# Altium project T1_Card.PrjPcb (part 4 of 6)

## Sheet LM74700.SchDoc
size 431 x 279 mm; Date: Not shown in title block; ApprovedBy: Not shown in title block; CheckedBy: Not shown in title block; Author: Not shown in title block; CompanyName: Not shown in title block; DrawnBy: Andy Lin (TI); Engineer: Not shown in title block; Organization: Not shown in title block; Address1: Not shown in title block; Address2: Not shown in title block; Address3: Not shown in title block; Address4: Not shown in title block; DocumentNumber: 4; Revision: Use project parameter SCH_Rev; SheetNumber: 4; SheetTotal: 14; PageSetup: Record=PageOptions|CenterHorizontal=True|CenterVertical=True|PrintScale=1.00|XCorrection=1.00|YCorrection=1.00|PrintKind=0|BorderSize=5000000|LeftOffset=0|BottomOffset=0|Orientation=2|PaperLength=1000|PaperWidth=1000|Scale=100|PaperSource=15|PrintQuality=600|MediaType=1|DitherType=10|PaperKind=Letter|PrintScaleMode=1; CurrentTime: Not shown in title block; CurrentDate: Not shown in title block; Time: Not shown in title block; DocumentFullPathAndName: Not shown in title block; DocumentName: Not shown in title block; ModifiedDate: Not shown in title block; ImagePath: Not shown in title block
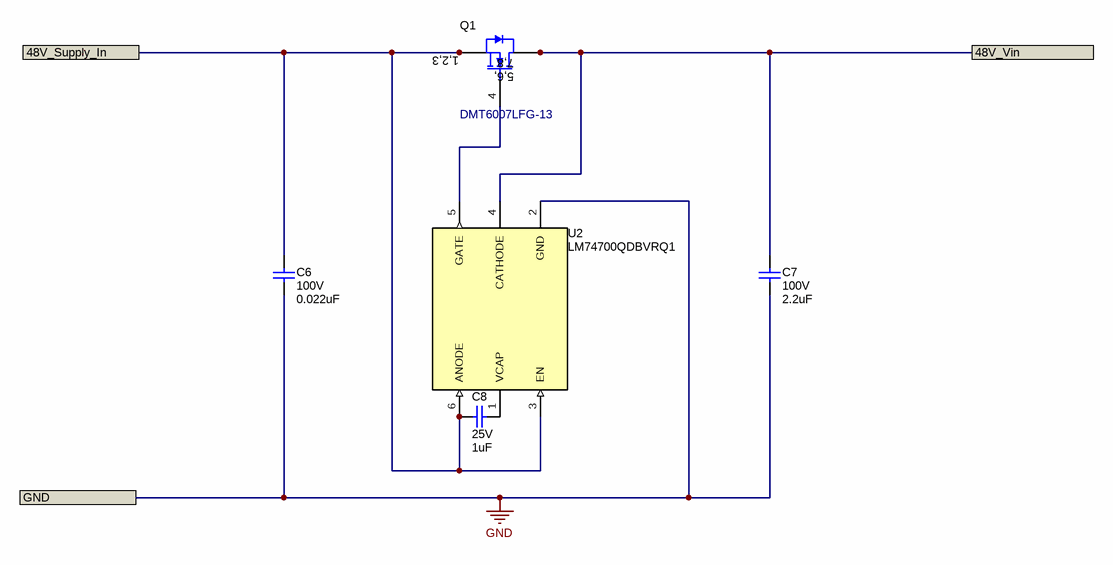
[diagram p7: LM74700.SchDoc]

### Parts
C6  VDC_V: 100V  ValueDisplayed: 0.022uF  [0805_HV]  (hidden comment: GRM21BR72A223KA01L)
C7  VDC_V: 100V  ValueDisplayed: 2.2uF  [1206_190]  (hidden comment: GRM31CR72A225KA73L)
C8  VDC_V: 25V  ValueDisplayed: 1uF  [0603]  (hidden comment: GCM188R71E105KA64D)
Q1  DMT6007LFG-13  [PowerDI3333-8]
U2  LM74700QDBVRQ1  [DBV0006A_N]

### Ports
48V_Supply_In, 48V_Vin, GND

### Nets
GND: C6.2 C7.2 U2.2(GND) ; port GND  [project net ILIM_GND]
48V_Supply_In: C6.1 C8.2 Q1.1(S) Q1.2(S) Q1.3(S) U2.3(EN) U2.6(ANODE) ; port 48V_Supply_In
48V_Vin: C7.1 Q1.5(D) Q1.6(D) Q1.7(D) Q1.8(D) Q1.9(D) U2.4(CATHODE) ; port 48V_Vin
NetC8_1: C8.1 U2.1(VCAP)
NetQ1_4: Q1.4(G) U2.5(GATE)

### Notes on the sheet
- Drawn By:
- SVN Rev:
- Number:
- TID #:
- Orderable:
- Rev:
- Sheet Title:
- File:
- Project Title:
- Designed for:
- Assembly Variant:
- Mod. Date:
- Sheet:
- Size:
- of
- B
- http://www.ti.com
- Texas Instruments and/or its licensors do not warrant the accuracy or completeness of this specification or any information contained therein. Texas Instruments and/or its licensors do not warrant that this design will meet the specifications, will be suitable for your application or fit for any particular purpose, or will operate in an implementation. Texas Instruments and/or its licensors do not warrant that the design is production worthy. You should completely validate and test your design implementation to confirm the system functionality for your application.
- Engineer:
- Contact:
- © Texas Instruments
- (in symbol CMP-0067553-1) 1,2,3; 7,8; 5,6,

### Library data of the parts
C6 = CMP-0008368-1: CAP, CERM, 0.022 uF, 100 V, +/- 10%, X7R, 0805; Manufacturer: MuRata; TaMin_C: -55°C; Polarized: N; SizeAreaWB_mm2: 6.75; Value1: Unknown; U/M: EA; TaMax_C: 125°C; SizeZ_mm: 1.45; SizeX_mm: 2; SizeY_mm: 1.25; Cap_Case: 0805; SizeArea_mm2: 2.5; Cap_F: 22nF; AEC Category: Q200; ComponentLink1URL: http://search.murata.co.jp/Ceramy/PnsearchViewAction.do?HnOFG=ON&HnNFG=ON&SEL_CNT=50&sLang=en&sKey=GRM21BR72A223KA01L&x=9&y=9&search=startwith; Supplier Part Number 2: 81-GRM21R72A223KA01L; Publisher: Texas Instruments; Supplier 2: Mouser; Supplier Part Number 3: 1403970; TempCo: X7R; Supplier 3: Farnell; Published: 2008-06-19; RoHS: Y; MountType: SMT; Value: 0.022uF; Supplier 1: Digi-Key; PackageReference: 0805; Tolerance_%: 10%; Value2: 100V; CompType: Capacitor; LatestRevisionDate: 2017-03-09; PartNumber: GRM21BR72A223KA01L; AEC Qualified: ?; ComponentLink1Description: Datasheet link; Supplier Part Number 1: 490-1658-1-ND; Technology: Ceramic
C7 = CMP-0008971-1: CAP, CERM, 2.2 uF, 100 V, +/- 10%, X7R, 1206_190; Manufacturer: MuRata; TaMin_C: -55°C; Polarized: N; SizeAreaWB_mm2: 10.92; Value1: Unknown; U/M: EA; Value: 2.2uF; TaMax_C: 125°C; SizeZ_mm: 1.9; SizeX_mm: 3.2; SizeY_mm: 1.6; Cap_Case: 1206; SizeArea_mm2: 5.12; Cap_F: 2.2µF; AEC Category: Q200; ComponentLink1URL: http://search.murata.co.jp/Ceramy/image/img/w_hinm/L0005E.pdf; Publisher: Texas Instruments; TempCo: X7R; Published: 2008-06-19; RoHS: Y; MountType: SMT; Supplier 1: Digi-Key; PackageReference: 1206_190; Tolerance_%: 10%; Value2: 100V; CompType: Capacitor; LatestRevisionDate: 2017-03-09; PartNumber: GRM31CR72A225KA73L; AEC Qualified: ?; ComponentLink1Description: Datasheet link; Supplier Part Number 1: 490-7209-1-ND; Technology: Ceramic
C8 = CMP-0007139-4: CAP, CERM, 1 uF, 25 V, +/- 10%, X7R, AEC-Q200 Grade 1, 0603; Manufacturer: MuRata; TaMin_C: -55°C; Polarized: N; SizeAreaWB_mm2: 4.68; Value1: Unknown; U/M: EA; Value: 1uF; TaMax_C: 125°C; SizeZ_mm: 1; SizeX_mm: 1.6; SizeY_mm: 0.8; SizeArea_mm2: 1.28; AEC Qualified: Y; Cap_F: 1µF; AEC Category: Q200; Supplier Part Number 2: 45Y5164; Publisher: Texas Instruments; Supplier 2: Newark; Supplier Part Number 3: 81-GCM188R71E105KA4D; TempCo: X7R; Supplier 3: Mouser; Published: 2008-06-19; RoHS: Y; MountType: SMT; Supplier 1: Digi-Key; PackageReference: 0603; Tolerance_%: 10%; Cap_Case: 0603; Value2: 25V; CompType: Capacitor; LatestRevisionDate: 2017-03-09; PartNumber: GCM188R71E105KA64D; ComponentLink1Description: Datasheet link; AEC Grade: 1; Supplier Part Number 1: 490-10673-1-ND; Technology: Ceramic; ComponentLink1URL: http://psearch.en.murata.com/capacitor/product/GCM188R71E105KA64%23.pdf
Q1 = CMP-0067553-1: MOSFET, N-CH, 60 V, 15 A, AEC-Q101, 8-PowerVDFN; Alternate Manufacturer: None; Manufacturer: Diodes Inc.; Rdson45_ohm: 8.5m; QgTyp_nC: 41.3; SizeAreaWB_mm2: 18.49; Vgs_V: 20V; Value1: 0.0085 ohm; VdsMax_V: 60V; U/M: EA; Value: 60V; IdsMax_A: 15A; SizeZ_mm: 0.8; SizeX_mm: 3.3; Value2: 41.3 nC; SizeArea_mm2: 10.89; ChType: N; AEC Qualified: Y; AEC Category: Q101; ComponentLink1URL: https://www.diodes.com/assets/Datasheets/DMT6007LFG.pdf; Supplier Part Number 2: 621-DMT6007LFG-13; Publisher: Texas Instruments; Supplier 2: Mouser; Published: 2008-06-19; RoHS: Y; MountType: SMT; Supplier 1: Digi-Key; LatestRevisionNote: Added parts.; PackageReference: 8-PowerVDFN; SizeY_mm: 3.3; CompType: MOSFET; LatestRevisionDate: 2017-06-05; PartNumber: DMT6007LFG-13; ComponentLink1Description: Datasheet link; Supplier Part Number 1: DMT6007LFG-13-ND
U2 = CMP-0013281-4: Low Iq Always ON Smart Diode Controller, DBV0006A (SOT-23-6); Alternate PartNumber: LM74700QDBVTQ1; Manufacturer: Texas Instruments; SizeZ_mm: 1.45; SizeX_mm: 2.8; SizeY_mm: 2.9; SizeArea_mm2: 8.12; CompType: IC; SizeAreaWB_mm2: 14.82; AEC Category: Q200; AEC Qualified: Y; ComponentLink1URL: http://www.ti.com/lit/ds/symlink/lm74700-q1.pdf; PackageDescription: SOT-23-6; PackageReference: DBV0006A; PartNumber: LM74700QDBVRQ1; ComponentLink1Description: Datasheet Link; MountType: SMT; Alternate Manufacturer: Texas Instruments; ComponentLink2Description: Product Folder; ComponentLink2URL: http://www.ti.com/product/lm74700-q1; ComponentLink3Description: Online Datasheet; ComponentLink3URL: http://www.ti.com/product/lm74700-q1/datasheet

## Sheet TPS2663.SchDoc
size 431 x 279 mm; Date: Not shown in title block; ApprovedBy: Not shown in title block; CheckedBy: Not shown in title block; Author: Not shown in title block; CompanyName: Not shown in title block; DrawnBy: Andy Lin (TI); Engineer: Not shown in title block; Organization: Not shown in title block; Address1: Not shown in title block; Address2: Not shown in title block; Address3: Not shown in title block; Address4: Not shown in title block; DocumentNumber: 5; Revision: Use project parameter SCH_Rev; SheetNumber: 5; SheetTotal: 14; PageSetup: Record=PageOptions|CenterHorizontal=True|CenterVertical=True|PrintScale=1.00|XCorrection=1.00|YCorrection=1.00|PrintKind=0|BorderSize=5000000|LeftOffset=0|BottomOffset=0|Orientation=2|PaperLength=1000|PaperWidth=1000|Scale=100|PaperSource=15|PrintQuality=600|MediaType=1|DitherType=10|PaperKind=Letter|PrintScaleMode=1; CurrentTime: Not shown in title block; CurrentDate: Not shown in title block; Time: Not shown in title block; DocumentFullPathAndName: Not shown in title block; DocumentName: Not shown in title block; ModifiedDate: Not shown in title block; ImagePath: Not shown in title block
Used 2 times, as channels U_T1_Card_Top/U_T1_Power_Top_Level/F1, U_T1_Card_Top/U_T1_Power_Top_Level/F2. Parts and nets are listed once, with the designators drawn on the sheet.
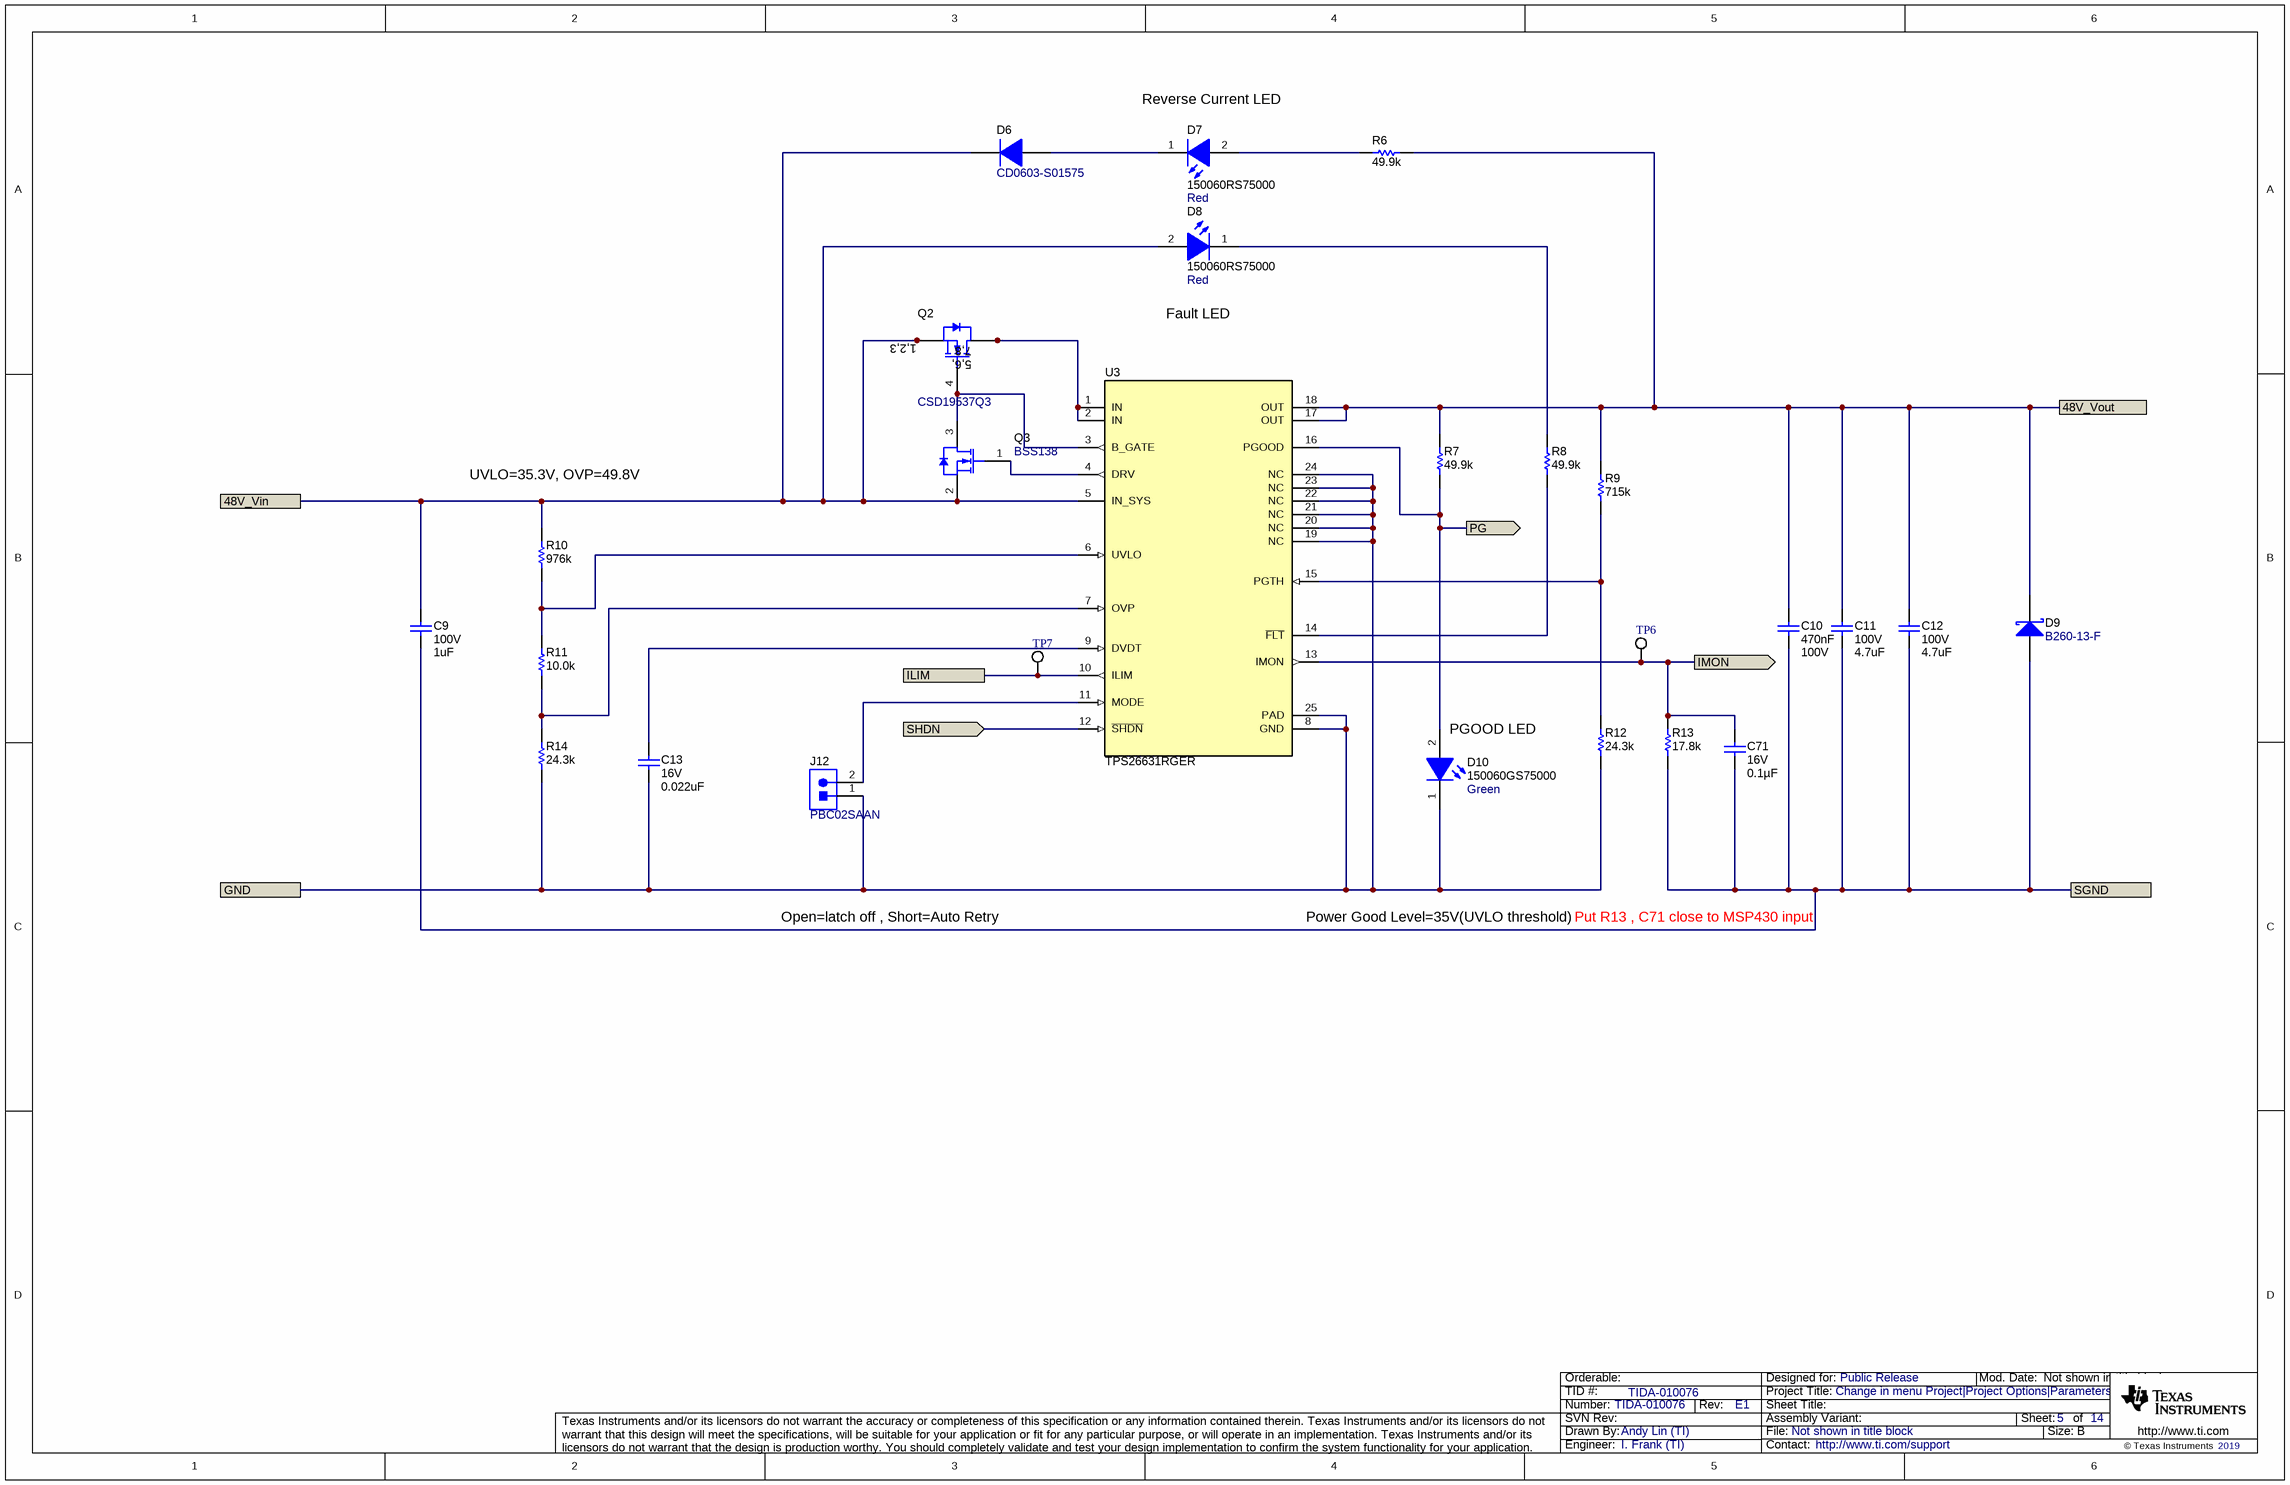
[diagram p8: TPS2663.SchDoc]

### Parts
C9  VDC_V: 100V  ValueDisplayed: 1uF  [1206_180]  (hidden comment: GRM31CR72A105KA01L)
C10  Cap_F: 470nF  VDC_V: 100V  [0805_HV]  (hidden comment: GRM21BR72A474KA73L)
C11  VDC_V: 100V  ValueDisplayed: 4.7uF  [1210_220]  (hidden comment: GRM32DC72A475KE01L)
C12  VDC_V: 100V  ValueDisplayed: 4.7uF  [1210_220]  (hidden comment: GRM32DC72A475KE01L)
C13  VDC_V: 16V  ValueDisplayed: 0.022uF  [0402]  (hidden comment: GRM155R71C223KA01D)
C71  VDC_V: 16V  ValueDisplayed: 0.1µF  [0402]  (hidden comment: GCM155R71C104JA55D)
D6  CD0603-S01575  [Diode_0603]
D7  150060RS75000  value Red  [WL-SMCW_RED]
D8  150060RS75000  value Red  [WL-SMCW_RED]
D9  B260-13-F  [SMB]
D10  150060GS75000  value Green  [WL-SMCW_GREEN]
J12  PBC02SAAN  [Sullins_PBC02SAAN]
Q2  CSD19537Q3  [DQG0008A]
Q3  BSS138  [SOT-23]
R6  ValueDisplayed: 49.9k  [0603]  (hidden comment: CRCW060349K9FKEA)
R7  ValueDisplayed: 49.9k  [0603]  (hidden comment: CRCW060349K9FKEA)
R8  ValueDisplayed: 49.9k  [0603]  (hidden comment: CRCW060349K9FKEA)
R9  ValueDisplayed: 715k  [0402]  (hidden comment: CRCW0402715KFKED)
R10  ValueDisplayed: 976k  [0402]  (hidden comment: CRCW0402976KFKED)
R11  ValueDisplayed: 10.0k  [0402]  (hidden comment: CRCW040210K0FKED)
R12  ValueDisplayed: 24.3k  [0402]  (hidden comment: CRCW040224K3FKED)
R13  ValueDisplayed: 17.8k  [0402]  (hidden comment: CRCW040217K8FKED)
R14  ValueDisplayed: 24.3k  [0402]  (hidden comment: CRCW040224K3FKED)
TP6  5002  [Keystone5002]  (value not drawn)
TP7  5002  [Keystone5002]  (value not drawn)
U3  TPS26631RGER  [RGE0024H]

### Ports
48V_Vin, 48V_Vout, GND, ILIM, IMON (out), PG (out), SGND, SHDN (in)

### Nets
48V_Vin: C9.1 D6.1(K) D8.2(A) Q2.1(S) Q2.2(S) Q2.3(S) Q3.2(S) R10.2 U3.5(IN_SYS) ; port 48V_Vin
48V_Vout: C10.1 C11.1 C12.1 D9.1(K) R6.1 R7.2 R9.2 U3.17(OUT) U3.18(OUT) ; port 48V_Vout
GND: C13.2 D10.1(K) J12.1 R12.1 R14.1 U3.8(GND) U3.19(NC) U3.20(NC) U3.21(NC) U3.22(NC) U3.23(NC) U3.24(NC) U3.25(PAD) ; port GND
ILIM: TP7.1 U3.10(ILIM) ; port ILIM
IMON: C71.1 R13.2 TP6.1 U3.13(IMON) ; port IMON
PG: D10.2(A) R7.1 U3.16(PGOOD) ; port PG
SGND: C9.2 C10.2 C11.2 C12.2 C71.2 D9.2(A) R13.1 ; port SGND
SHDN: U3.12(~{SHDN}) ; port SHDN
NetC13_1: C13.1 U3.9(DVDT)
NetD6_2: D6.2(A) D7.1(K)
NetD7_2: D7.2(A) R6.2
NetD8_1: D8.1(K) R8.2
NetJ12_2: J12.2 U3.11(MODE)
NetQ2_4: Q2.4(G) Q3.3(D) U3.3(B_GATE)
NetQ2_5: Q2.5(D) Q2.6(D) Q2.7(D) Q2.8(D) Q2.9(D) U3.1(IN) U3.2(IN)
NetQ3_1: Q3.1(G) U3.4(DRV)
NetR8_1: R8.1 U3.14(~{FLT})
NetR9_1: R9.1 R12.2 U3.15(PGTH)
NetR10_1: R10.1 R11.2 U3.6(UVLO)
NetR11_1: R11.1 R14.2 U3.7(OVP)

### Channels
U_T1_Card_Top/U_T1_Power_Top_Level/F1: designators end in _F1; ports 48V_Vin=48V_Vin 48V_Vout=48V_Vout GND=ILIM_GND ILIM=ILIM IMON=IMON PG=PG SGND=SGND SHDN=SHDN
U_T1_Card_Top/U_T1_Power_Top_Level/F2: designators end in _F2; ports 48V_Vin=48V_Vin 48V_Vout=48V_Vout GND=ILIM_GND ILIM=ILIM IMON=IMON PG=PG SGND=SGND SHDN=SHDN

### Notes on the sheet
- (near D7) Reverse Current LED
- Fault LED
- UVLO=35.3V, OVP=49.8V
- (near D10) PGOOD LED
- Open=latch off , Short=Auto Retry
- Power Good Level=35V(UVLO threshold)
- Put R13 , C71 close to MSP430 input
- Drawn By:
- SVN Rev:
- Number:
- TID #:
- Orderable:
- Rev:
- Sheet Title:
- File:
- Project Title:
- Designed for:
- Assembly Variant:
- Mod. Date:
- Sheet:
- Size:
- of
- B
- http://www.ti.com
- Texas Instruments and/or its licensors do not warrant the accuracy or completeness of this specification or any information contained therein. Texas Instruments and/or its licensors do not warrant that this design will meet the specifications, will be suitable for your application or fit for any particular purpose, or will operate in an implementation. Texas Instruments and/or its licensors do not warrant that the design is production worthy. You should completely validate and test your design implementation to confirm the system functionality for your application.
- Engineer:
- Contact:
- © Texas Instruments
- (in symbol CMP-0000967-2) 1,2,3; 7,8; 5,6,

### Library data of the parts
C9 = CMP-0008970-1: CAP, CERM, 1 uF, 100 V, +/- 10%, X7R, 1206; Manufacturer: MuRata; TaMin_C: -55°C; Polarized: N; SizeAreaWB_mm2: 10.92; Value1: Unknown; U/M: EA; Value: 1uF; TaMax_C: 125°C; SizeZ_mm: 1.8; SizeX_mm: 3.2; SizeY_mm: 1.6; Cap_Case: 2220; SizeArea_mm2: 5.12; Cap_F: 1µF; AEC Category: Q200; ComponentLink1URL: http://search.murata.co.jp/Ceramy/PnsearchViewAction.do?HnOFG=ON&HnNFG=ON&SEL_CNT=50&sLang=en&sKey=GRM31CR72A105KA01L&x=9&y=9&search=startwith; Supplier Part Number 2: 81-GRM31CR72A105KA01; Publisher: Texas Instruments; Supplier 2: Mouser; Supplier Part Number 3: 1735543; TempCo: X7R; Supplier 3: Farnell; Published: 2008-06-19; RoHS: Y; MountType: SMT; Supplier 1: Digi-Key; PackageReference: 1206; Tolerance_%: 10%; Value2: 100V; CompType: Capacitor; LatestRevisionDate: 2017-03-09; PartNumber: GRM31CR72A105KA01L; AEC Qualified: ?; ComponentLink1Description: Datasheet link; Supplier Part Number 1: 490-3909-1-ND; Technology: Ceramic
C10 = CMP-0008374-2: CAP, CERM, 0.47 uF, 100 V, +/- 10%, X7R, 0805; Manufacturer: MuRata; TaMin_C: -55°C; Polarized: N; SizeAreaWB_mm2: 6.75; Value1: Unknown; U/M: EA; Value: 0.47uF; TaMax_C: 125°C; SizeZ_mm: 1.45; SizeX_mm: 2; SizeY_mm: 1.25; Cap_Case: 0805; SizeArea_mm2: 2.5; AEC Category: Q200; Supplier Part Number 2: 81-GRM21BR72A474KA73; Publisher: Texas Instruments; Supplier 2: Mouser; TempCo: X7R; Published: 2008-06-19; RoHS: Y; MountType: SMT; Supplier 1: Digi-Key; PackageReference: 0805; Tolerance_%: 10%; Value2: 100V; CompType: Capacitor; LatestRevisionDate: 2017-03-09; PartNumber: GRM21BR72A474KA73L; AEC Qualified: ?; ComponentLink1Description: Datasheet link; Supplier Part Number 1: 490-3326-1-ND; Technology: Ceramic; ValueDisplayed: 0.47uF; ComponentLink1URL: http://search.murata.co.jp/Ceramy/PnsearchViewAction.do?HnOFG=ON&HnNFG=ON&SEL_CNT=50&sLang=en&sKey=GRM21BR72A474KA73L&x=9&y=9&search=startwith
C11 C12 = CMP-0009182-2: CAP, CERM, 4.7 uF, 100 V, +/- 10%, X7S, 1210; Manufacturer: MuRata; TaMin_C: -55°C; Polarized: N; SizeAreaWB_mm2: 14.7; Value1: Unknown; U/M: EA; Value: 4.7uF; TaMax_C: 125°C; SizeZ_mm: 2.2; SizeX_mm: 3.2; SizeY_mm: 2.5; Cap_Case: 1210; SizeArea_mm2: 8; Cap_F: 4.7µF; AEC Category: Q200; Publisher: Texas Instruments; TempCo: X7S; Published: 2008-06-19; RoHS: Y; MountType: SMT; Supplier 1: Mouser; PackageReference: 1210; Tolerance_%: 10%; Value2: 100V; CompType: Capacitor; LatestRevisionDate: 2017-03-09; PartNumber: GRM32DC72A475KE01L; AEC Qualified: N; ComponentLink1Description: Datasheet link; AEC Grade: N/A; Supplier Part Number 1: 81-GRM32DC72A475KE1L; Technology: Ceramic; ComponentLink1URL: http://search.murata.co.jp/Ceramy/image/img/A01X/G101/ENG/GRM32DC72A475KE01-01.pdf
C13 = CMP-0006647-2: CAP, CERM, 0.022 uF, 16 V, +/- 10%, X7R, 0402; Manufacturer: MuRata; TaMin_C: -55°C; Polarized: N; SizeAreaWB_mm2: 3; Value1: Unknown; U/M: EA; TaMax_C: 125°C; SizeZ_mm: 0.6; SizeX_mm: 1; SizeY_mm: 0.5; Cap_F: 22nF; AEC Category: Q200; Supplier Part Number 2: 81-GRM36X223K16; Publisher: Texas Instruments; Supplier 2: Mouser; Supplier Part Number 3: 1828865; TempCo: X7R; Supplier 3: Farnell; Published: 2008-06-19; RoHS: Y; MountType: SMT; Value: 0.022uF; Supplier 1: Digi-Key; PackageReference: 0402; Tolerance_%: 10%; Cap_Case: 0402; Value2: 16V; SizeArea_mm2: 0.5; CompType: Capacitor; LatestRevisionDate: 2017-03-09; PartNumber: GRM155R71C223KA01D; AEC Qualified: ?; ComponentLink1Description: Datasheet link; Supplier Part Number 1: 490-3256-1-ND; Technology: Ceramic; ComponentLink1URL: http://search.murata.co.jp/Ceramy/PnsearchViewAction.do?HnOFG=ON&HnNFG=ON&SEL_CNT=50&sLang=en&sKey=GRM155R71C223KA01D&x=9&y=9&search=startwith
C71 = CMP-0080702-1: CAP, CERM, 0.1 µF, 16 V,+/- 5%, X7R, AEC-Q200 Grade 1, 0402; Manufacturer: MuRata; Cap_F: 100nF; SizeAreaWB_mm2: 3; SizeArea_mm2: 0.5; AEC Qualified: Y; AEC Category: Q200; Value: 0.1uF; TaMax_C: 125°C; SizeZ_mm: 0.6; AEC Grade: 1; Polarized: N; TaMin_C: -55°C; U/M: EA; ComponentLink1Description: Datasheet link; RoHS: Y; Tolerance_%: 5%; Supplier 1: Digi-Key; PackageReference: 0402; Technology: Ceramic; PartNumber: GCM155R71C104JA55D; TempCo: X7R; Supplier Part Number 2: 81-GCM155R71C104JA5D; Supplier 2: Mouser; SizeY_mm: 0.5; Value2: 16V; ComponentLink1URL: https://search.murata.co.jp/Ceramy/image/img/A01X/G101/ENG/GCM155R71C104JA55-01.pdf; CompType: Capacitor; MountType: SMT; Supplier Part Number 1: 490-16433-1-ND; SizeX_mm: 1; Cap_Case: 0402
D6 = CMP-0029008-2: Diode, Switching, 100 V, 0.15 A, 0603 Diode; Manufacturer: Bourns; Vf_V: 1V; SizeAreaWB_mm2: 5.13; SizeX_mm: 1.7; Value1: 0.15A; Green_Lifecycle: Not Set; Io_A: 150mA; SizeArea_mm2: 1.53; SizeY_mm: 0.9; AEC Category: Q101; Vr_V: 100V; TJmax_C: 125°C; SizeZ_mm: 0.75; Green_REACh: Incomplete; Value: 100V; Green_EU RoHS: Incomplete; AEC Qualified: ?; Green_EU RoHS-2: Incomplete; MountType: SMT; CompType: Diode; ComponentLink1URL: http://www.bourns.com/pdfs/CD0603_1005.pdf; RoHS: Y; PartNumber: CD0603-S01575; PackageReference: 0603 Diode; Type: Switching; Value2: 1V; ComponentLink1Description: Datasheet link
D7 D8 = CMP-0002947-3: LED, Red, SMD; Manufacturer: Wurth Elektronik; Value1: 0.072W; Vf_V: 2V; Angle: 140; Tjmax_C: 85°C; Type: AlInGaP; Vr_V: 5V; Io_A: 30mA; Power_TotalModule: 72mW; RoHS: Y; Color: Red; ComponentLink1Description: Datasheet link; PackageReference: LED_0603; ComponentLink1URL: http://katalog.we-online.de/led/datasheet/150060RS75000.pdf; Value2: 2V; MountType: SMT; CompType: LED; PartNumber: 150060RS75000
D9 = CMP-0028406-2: Diode, Schottky, 60 V, 2 A, SMB; Manufacturer: Diodes Inc.; SizeArea_mm2: 21.336; Value1: 2A; Green_Lifecycle: Active; Vf_V: 700mV; SizeX_mm: 5.6; TJmax_C: 150°C; SizeZ_mm: 2.6; Green_REACh: Passed; Vr_V: 60V; Value2: 0.7V; RJC_CperW: 20; Value: 60V; AEC Category: Q101; SizeY_mm: 3.81; SizeAreaWB_mm2: 44.156; PackageReference: SMB; AEC Qualified: ?; Type: Schottky; Green_EU RoHS: Passed with Exemption; Green_EU RoHS-2: Passed; ComponentLink1Description: Datasheet link; Io_A: 2A; RoHS: Y; CompType: Diode; MountType: SMT; PartNumber: B260-13-F; ComponentLink1URL: http://www.diodes.com/datasheets/ds13004.pdf
D10 = CMP-0002905-2: LED, Green, SMD; Manufacturer: Wurth Elektronik; Value1: W; Type: InGaN; Value2: 3.2V; Io_A: 20mA; Angle: 140; Tjmax_C: 85°C; Color: Green; Vf_V: 3.2V; PartNumber: 150060GS75000; ComponentLink1Description: Datasheet link; ComponentLink1URL: http://katalog.we-online.de/led/datasheet/150060GS75000.pdf; MountType: SMT; PackageReference: LED_0603; CompType: LED; RoHS: Y
J12 = CMP-0054566-1: Header, 100mil, 2x1, Gold, TH; Manufacturer: Sullins Connector Solutions; CNHeader: TRUE; Current_A: 3A; Green_Lifecycle: Active; Shrouded: N; Gender: Male; Green_REACh: Passed; Voltage_V: 1.8kV; Row_Count: 1; Pitch_mm: 2.54; CT: FALSE; Cert_UL: Y; ComponentLink1URL: http://www.sullinscorp.com/catalogs/77_PAGE108-109_.100_MALE_HDR.pdf; ClassName: Header; Publisher: Texas Instruments; Color: Black; RoHS: Y; MountType: TH; Green_EU RoHS-2: Passed; Supplier 1: Digi-Key; Green_EU RoHS: Passed; PackageReference: Sullins 100mil, 1x2, 230 mil above insulator; PinCount: 2; CompType: Header; LatestRevisionDate: 26/05/2017; PartNumber: PBC02SAAN; Orientation: Vertical; ComponentLink1Description: Datasheet URL; Supplier Part Number 1: S1011E-02-ND; ContactFinish: Gold
Q2 = CMP-0000967-2: MOSFET, N-CH, 100 V, 50 A, DQG0008A (VSON-CLIP-8); Alternate Manufacturer: None; Manufacturer: Texas Instruments; SizeZ_mm: 1.1; ChType: N; Value2: 16 nC; VdsMax_V: 100V; SizeX_mm: 3.3; Vgs_V: 20V; QgTyp_nC: 16; Value: 100V; SizeArea_mm2: 10.89; AEC Category: Q101; IdsMax_A: 50A; SizeAreaWB_mm2: 18.49; U/M: EA; Supplier 2: Mouser; Supplier 1: Digi-Key; Supplier Part Number 1: CSD19537Q3-ND; Supplier Part Number 2: 595-CSD19537Q3; PartNumber: CSD19537Q3; ComponentLink1Description: Datasheet link; LatestRevisionDate: 2017-03-09; SizeY_mm: 3.3; CompType: MOSFET; LatestRevisionNote: Added parts.; Publisher: Texas Instruments; AEC Qualified: N; Published: 2008-06-19; RoHS: Y; PackageReference: DQG0008A; MountType: SMT; ComponentLink1URL: http://www.ti.com/lit/ds/symlink/csd19537q3.pdf
Q3 = CMP-0000755-1: MOSFET, N-CH, 50 V, 0.22 A, SOT-23; Alternate Manufacturer: None; Manufacturer: Fairchild Semiconductor; SizeZ_mm: 1.1; ChType: N; Value2: 1.7 nC; VdsMax_V: 50V; SizeX_mm: 2.5; SizeY_mm: 3; Vgs_V: 20V; Value: 50V; Rdson45_ohm: 6; SizeArea_mm2: 7.5; AEC Category: Q101; IdsMax_A: 220mA; SizeAreaWB_mm2: 14; U/M: EA; QgTyp_nC: 1.7; Supplier 2: Newark; Supplier 3: Mouser; Supplier 1: Digi-Key; Supplier Part Number 1: BSS138CT-ND; Supplier Part Number 2: 58K8769; PartNumber: BSS138; ComponentLink1Description: Datasheet link; LatestRevisionDate: 2017-03-09; ComponentLink1URL: http://www.fairchildsemi.com/ds/BS/BSS138.pdf; CompType: MOSFET; PackageReference: SOT-23; LatestRevisionNote: Added parts.; Publisher: Texas Instruments; AEC Qualified: ?; Published: 2008-06-19; Supplier Part Number 3: 512-BSS138; RoHS: Y; MountType: SMT
R6-R8 = CMP-0022447-1: RES, 49.9 k, 1%, 0.1 W, 0603; Manufacturer: Vishay-Dale; Power_W: 100mW; TempCo: 100 ppm/C; Value_Code: 49k9; U/M: EA; Value: 49.9k; EIA_Code: E96; SizeX_mm: 1.6; SizeY_mm: 0.8; SizeZ_mm: 1; Value2: 0.1W; SizeArea_mm2: 1.28; VDC_V: 75V; AEC Category: Q200; ComponentLink1URL: http://www.vishay.com/docs/20035/dcrcwe3.pdf; Supplier Part Number 2: 71-CRCW0603-49.9K-E3; Publisher: Texas Instruments; Supplier 2: Mouser; Supplier Part Number 3: 1652882; Supplier 3: Farnell; Published: 2008-06-26; RoHS: Y; Value1: 1%; MountType: SMT; Supplier 1: Digi-Key; PackageReference: 0603; Tolerance_%: 1%; Res_ohm: 49.9k; CompType: Resistor; LatestRevisionDate: 2017-03-09; PartNumber: CRCW060349K9FKEA; AEC Qualified: ?; ComponentLink1Description: Datasheet link; Supplier Part Number 1: 541-49.9KHCT-ND; Technology: Thick Film
R9 = CMP-0026533-2: RES, 715 k, 1%, 0.063 W, AEC-Q200 Grade 0, 0402; Manufacturer: Vishay-Dale; Power_W: 63mW; TempCo: 100 ppm/C; Value: 715k; EIA_Code: E96; SizeX_mm: 1; SizeY_mm: 0.5; SizeZ_mm: 0.6; Value2: 0.063W; AEC Qualified: Y; VDC_V: 50V; AEC Category: Q200; AEC Grade: 0; ComponentLink1URL: http://www.vishay.com/docs/20035/dcrcwe3.pdf; Supplier Part Number 2: 71-CRCW0402-715K-E3; Supplier 2: Mouser; Supplier Part Number 3: 1151471; Supplier 3: Farnell; Value_Code: 715k; RoHS: E; Value1: 1%; MountType: SMT; Supplier 1: Digi-Key; PackageReference: 0402; Tolerance_%: 1%; Res_ohm: 715k; SizeArea_mm2: 0.5; CompType: Resistor; PartNumber: CRCW0402715KFKED; ComponentLink1Description: Datasheet link; Supplier Part Number 1: 541-715KLCT-ND; Technology: Thick Film
R10 = CMP-0026615-3: RES, 976 k, 1%, 0.063 W, AEC-Q200 Grade 0, 0402; Manufacturer: Vishay-Dale; Power_W: 63mW; TempCo: 100 ppm/C; Value: 976k; EIA_Code: E96; SizeX_mm: 1; SizeY_mm: 0.5; SizeZ_mm: 0.6; Value2: 0.063W; AEC Qualified: Y; VDC_V: 50V; AEC Category: Q200; AEC Grade: 0; ComponentLink1URL: http://www.vishay.com/docs/20035/dcrcwe3.pdf; Supplier Part Number 2: 52K7358; Supplier 2: Newark; Supplier Part Number 3: 71-CRCW0402-976K-E3; Supplier 3: Mouser; Value_Code: 976k; RoHS: E; Value1: 1%; MountType: SMT; Supplier 1: Digi-Key; PackageReference: 0402; Tolerance_%: 1%; Res_ohm: 976k; SizeArea_mm2: 0.5; CompType: Resistor; PartNumber: CRCW0402976KFKED; ComponentLink1Description: Datasheet link; Supplier Part Number 1: 541-976KLCT-ND; Technology: Thick Film
R11 = CMP-0025958-3: RES, 10.0 k, 1%, 0.063 W, AEC-Q200 Grade 0, 0402; Manufacturer: Vishay-Dale; Power_W: 63mW; TempCo: 100 ppm/C; Value_Code: 10k0; Value: 10.0k; EIA_Code: E96; Res_ohm: 10k; SizeX_mm: 1; SizeY_mm: 0.5; SizeZ_mm: 0.6; Value2: 0.063W; AEC Qualified: Y; VDC_V: 50V; AEC Category: Q200; AEC Grade: 0; Supplier Part Number 2: 52K6595; Supplier 2: Newark; Supplier Part Number 3: 71-CRCW0402-10K-E3; Supplier 3: Mouser; RoHS: E; Value1: 1%; MountType: SMT; Supplier 1: Digi-Key; PackageReference: 0402; Tolerance_%: 1%; SizeArea_mm2: 0.5; CompType: Resistor; PartNumber: CRCW040210K0FKED; ComponentLink1Description: Datasheet link; Supplier Part Number 1: 541-10.0KLCT-ND; Technology: Thick Film; ComponentLink1URL: http://www.vishay.com/docs/20035/dcrcwe3.pdf
R12 R14 = CMP-0026195-2: RES, 24.3 k, 1%, 0.063 W, AEC-Q200 Grade 0, 0402; Manufacturer: Vishay-Dale; Power_W: 63mW; TempCo: 100 ppm/C; Value_Code: 24k3; Value: 24.3k; EIA_Code: E96; SizeX_mm: 1; SizeY_mm: 0.5; SizeZ_mm: 0.6; Value2: 0.063W; AEC Qualified: Y; VDC_V: 50V; AEC Category: Q200; AEC Grade: 0; ComponentLink1URL: http://www.vishay.com/docs/20035/dcrcwe3.pdf; Supplier Part Number 2: 52K6874; Supplier 2: Newark; Supplier Part Number 3: 71-CRCW0402-24.3K-E3; Supplier 3: Mouser; RoHS: E; Value1: 1%; MountType: SMT; Supplier 1: Digi-Key; PackageReference: 0402; Tolerance_%: 1%; Res_ohm: 24.3k; SizeArea_mm2: 0.5; CompType: Resistor; PartNumber: CRCW040224K3FKED; ComponentLink1Description: Datasheet link; Supplier Part Number 1: 541-24.3KLCT-ND; Technology: Thick Film
R13 = CMP-0026051-3: RES, 17.8 k, 1%, 0.063 W, AEC-Q200 Grade 0, 0402; Manufacturer: Vishay-Dale; Power_W: 63mW; TempCo: 100 ppm/C; Value_Code: 17k8; Value: 17.8k; EIA_Code: E96; SizeX_mm: 1; SizeY_mm: 0.5; SizeZ_mm: 0.6; Value2: 0.063W; AEC Qualified: Y; VDC_V: 50V; AEC Category: Q200; AEC Grade: 0; Supplier Part Number 2: 52K6746; Supplier 2: Newark; Supplier Part Number 3: 71-CRCW0402-17.8K-E3; Supplier 3: Mouser; RoHS: E; Value1: 1%; MountType: SMT; Supplier 1: Digi-Key; PackageReference: 0402; Tolerance_%: 1%; Res_ohm: 17.8k; SizeArea_mm2: 0.5; CompType: Resistor; PartNumber: CRCW040217K8FKED; ComponentLink1Description: Datasheet link; Supplier Part Number 1: 541-17.8KLCT-ND; Technology: Thick Film; ComponentLink1URL: http://www.vishay.com/docs/20035/dcrcwe3.pdf
TP6 TP7 = CMP-0055139-1: Test Point, Miniature, White, TH; Manufacturer: Keystone; CNHeader: FALSE; Green_Lifecycle: Active; Green_REACh: Passed; ContactFinish: Silver; CT: TRUE; ComponentLink1URL: http://www.keyelco.com/userAssets/file/M60-2p60.pdf; Supplier Part Number 2: 82H9632; Publisher: Texas Instruments; Supplier 2: Newark; Supplier Part Number 3: 534-5002; Color: White; Supplier 3: Mouser; RoHS: Y; MountType: TH; Green_EU RoHS-2: Passed; Supplier 1: Digi-Key; Green_EU RoHS: Passed; PackageReference: White Miniature Testpoint; CompType: Test Point; LatestRevisionDate: 26/05/2017; PartNumber: 5002; ComponentLink1Description: Datasheet URL; Supplier Part Number 1: 36-5002-ND
U3 = CMP-0080692-2: 4.5V - 60V, 6A 29mΩ eFuse with Reverse Polarity Protection, RGE0024H (VQFN-24); Alternate PartNumber: TPS26631RGET; Alternate Manufacturer: Texas Instruments; SizeX_mm: 4; AEC Qualified: N; AEC Category: Q200; SizeAreaWB_mm2: 25; SizeArea_mm2: 16; SizeZ_mm: 1; CompType: IC; ComponentLink1URL: http://www.ti.com/lit/ds/symlink/tps26631.pdf; PartNumber: TPS26631RGER; SizeY_mm: 4; ComponentLink3URL: http://www.ti.com/product/tps26631/datasheet; ComponentLink2URL: http://www.ti.com/product/tps26631; ComponentLink2Description: Product Folder; PackageReference: RGE0024H; PackageDescription: VQFN-24; ComponentLink3Description: Online Datasheet; MountType: SMT; ComponentLink1Description: Datasheet Link; Manufacturer: Texas Instruments

## Sheet LP2951.SchDoc
size 431 x 279 mm; Date: Not shown in title block; ApprovedBy: Not shown in title block; CheckedBy: Not shown in title block; Author: Not shown in title block; CompanyName: Not shown in title block; DrawnBy: Andy Lin (TI); Engineer: Not shown in title block; Organization: Not shown in title block; Address1: Not shown in title block; Address2: Not shown in title block; Address3: Not shown in title block; Address4: Not shown in title block; DocumentNumber: 9; Revision: Use project parameter SCH_Rev; SheetNumber: 9; SheetTotal: 14; PageSetup: Record=PageOptions|CenterHorizontal=True|CenterVertical=True|PrintScale=1.00|XCorrection=1.00|YCorrection=1.00|PrintKind=0|BorderSize=5000000|LeftOffset=0|BottomOffset=0|Orientation=2|PaperLength=1000|PaperWidth=1000|Scale=100|PaperSource=15|PrintQuality=600|MediaType=1|DitherType=10|PaperKind=Letter|PrintScaleMode=1; CurrentTime: Not shown in title block; CurrentDate: Not shown in title block; Time: Not shown in title block; DocumentFullPathAndName: Not shown in title block; DocumentName: Not shown in title block; ModifiedDate: Not shown in title block; ImagePath: Not shown in title block
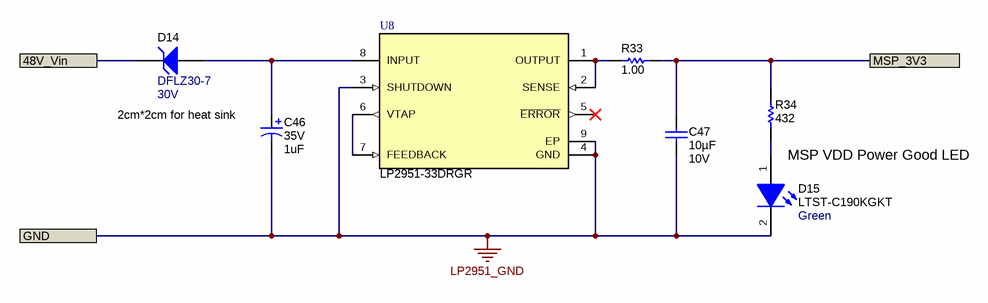
[diagram p9: LP2951.SchDoc]

### Parts
C46  VDC_V: 35V  ValueDisplayed: 1uF  [3528-21]  (hidden comment: 293D105X9035B2TE3)
C47  Cap_F: 10µF  VDC_V: 10V  [0603]  (hidden comment: GRM188Z71A106MA73D)
D14  DFLZ30-7  value 30V  [PowerDI123]
D15  LTST-C190KGKT  value Green  [LED_LTST-C190_G]
R33  ValueDisplayed: 1.00  [0603]  (hidden comment: CRCW06031R00FKEA)
R34  ValueDisplayed: 432  [0603]  (hidden comment: CRCW0603432RFKEA)
U8  LP2951-33DRGR  [DRG0008A]

### Ports
48V_Vin, GND, MSP_3V3

### Nets
LP2951_GND: C46.2(-) C47.2 D15.2(K) U8.3(SHUTDOWN) U8.4(GND) U8.9(EP) ; port GND  [project net ILIM_GND]
48V_Vin: D14.1(K) ; port 48V_Vin
MSP_3V3: C47.1 R33.1 R34.2 ; port MSP_3V3
NetC46_1: C46.1(+) D14.2(A) U8.8(INPUT)
NetD15_1: D15.1(A) R34.1
NetR33_2: R33.2 U8.1(OUTPUT) U8.2(SENSE)
NetU8_6: U8.6(VTAP) U8.7(FEEDBACK)

Not connected (* = marked no-connect by the designer): U8 5(~{ERROR})*

### Notes on the sheet
- 2cm*2cm for heat sink
- MSP VDD Power Good LED
- Drawn By:
- SVN Rev:
- Number:
- TID #:
- Orderable:
- Rev:
- Sheet Title:
- File:
- Project Title:
- Designed for:
- Assembly Variant:
- Mod. Date:
- Sheet:
- Size:
- of
- B
- http://www.ti.com
- Texas Instruments and/or its licensors do not warrant the accuracy or completeness of this specification or any information contained therein. Texas Instruments and/or its licensors do not warrant that this design will meet the specifications, will be suitable for your application or fit for any particular purpose, or will operate in an implementation. Texas Instruments and/or its licensors do not warrant that the design is production worthy. You should completely validate and test your design implementation to confirm the system functionality for your application.
- Engineer:
- Contact:
- © Texas Instruments

### Library data of the parts
C46 = CMP-0011509-2: CAP, TA, 1 uF, 35 V, +/- 10%, 5 ohm, SMD; Manufacturer: Vishay-Sprague; TaMin_C: -55°C; ESR_ohm: 5; Polarized: Y; SizeAreaWB_mm2: 17.1; Value1: 5 ohm; U/M: EA; Value: 1uF; TaMax_C: 125°C; SizeZ_mm: 2.1; SizeX_mm: 3.5; SizeY_mm: 2.8; Cap_Case: B; SizeArea_mm2: 9.8; CompType: Capacitor; Cap_F: 1µF; IRMS_A: 130mA; AEC Category: Q200; Supplier Part Number 2: 74-293D105X9035B2TE3; Publisher: Texas Instruments; Supplier 2: Mouser; Supplier Part Number 3: 1754225; Supplier 3: Farnell; RoHS: Y; MountType: SMT; Supplier 1: Digi-Key; LatestRevisionNote: Updated supplier links; PackageReference: 3528-21; Tolerance_%: 10%; Value2: 35V; LatestRevisionDate: 2017-03-09; PartNumber: 293D105X9035B2TE3; AEC Qualified: ?; Series: 293D; ComponentLink1Description: Datasheet link; Supplier Part Number 1: 718-1117-1-ND; Technology: TA; ComponentLink1URL: http://www.vishay.com/docs/40002/293d.pdf
C47 = CMP-0007497-5: CAP, CERM, 10 uF, 10 V, +/- 20%, X7R, 0603; Manufacturer: MuRata; TaMin_C: -55°C; Polarized: N; SizeAreaWB_mm2: 4.68; Value1: Unknown; U/M: EA; Value: 10uF; TaMax_C: 125°C; SizeZ_mm: 1; SizeX_mm: 1.6; SizeY_mm: 0.8; SizeArea_mm2: 1.28; AEC Category: Q200; Publisher: Texas Instruments; TempCo: X7R; Published: 2008-06-19; RoHS: Y; MountType: SMT; Supplier 1: Mouser; PackageReference: 0603; Tolerance_%: 20%; Cap_Case: 0603; Value2: 10V; CompType: Capacitor; LatestRevisionDate: 2017-03-09; PartNumber: GRM188Z71A106MA73D; AEC Qualified: N; ComponentLink1Description: Datasheet link; AEC Grade: N/A; Supplier Part Number 1: 81-GRM188Z71A106MA3D; Technology: Ceramic; ValueDisplayed: 10uF; ComponentLink1URL: http://psearch.en.murata.com/capacitor/product/GRM188Z71A106MA73%23.pdf
D14 = CMP-0005417-4: Diode, Zener, 30 V, 1 W, PowerDI123; Manufacturer: Diodes Inc.; SizeX_mm: 3.7; Power_W: 1W; SizeY_mm: 1.78; AEC Category: Q101; RJA_CperW: 110; SizeArea_mm2: 6.586; SizeZ_mm: 0.98; SizeAreaWB_mm2: 13.066; AEC Qualified: ?; ComponentLink1Description: Datasheet link; MountType: SMT; Vz_V: 30V; Value1: 1W; ComponentLink1URL: http://www.diodes.com/datasheets/ds30464.pdf; PartNumber: DFLZ30-7; CompType: Zener; PackageReference: PowerDI123; RoHS: Y
D15 = CMP-0002840-2: LED, Green, SMD; Manufacturer: Lite-On; Value1: W; Io_A: 30mA; Value2: 2V; Tjmax_C: 85°C; Type: AlInGaP; PartNumber: LTST-C190KGKT; MountType: SMT; CompType: LED; Color: green; ComponentLink1Description: Datasheet link; RoHS: Y; ComponentLink1URL: http://optoelectronics.liteon.com/en-us/api/DwonloadFileHandler.ashx?txtSpecNo=DS22-2000-074&txtPartNo=LTST-C190KGKT; Vf_V: 2V; PackageReference: 1.6x0.8x0.8mm
R33 = CMP-0022170-1: RES, 1.00, 1%, 0.1 W, 0603; Manufacturer: Vishay-Dale; Power_W: 100mW; TempCo: 100 ppm/C; Value_Code: 1R00; U/M: EA; Value: 1.00; EIA_Code: E96; Res_ohm: 1; SizeX_mm: 1.6; SizeY_mm: 0.8; Value2: 0.1W; SizeArea_mm2: 1.28; VDC_V: 75V; AEC Category: Q200; ComponentLink1URL: http://www.vishay.com/docs/20035/dcrcwe3.pdf; Supplier Part Number 2: 71-CRCW06031R00FKEA; Publisher: Texas Instruments; Supplier 2: Mouser; Supplier Part Number 3: 1616871; Supplier 3: Farnell; Published: 2008-06-26; RoHS: Y; Value1: 1%; MountType: SMT; Supplier 1: Newark; PackageReference: 0603; Tolerance_%: 1%; SizeZ_mm: 1; CompType: Resistor; LatestRevisionDate: 2017-03-09; PartNumber: CRCW06031R00FKEA; AEC Qualified: ?; ComponentLink1Description: Datasheet link; Supplier Part Number 1: 52K8059; Technology: Thick Film
R34 = CMP-0022421-5: RES, 432, 1%, 0.1 W, AEC-Q200 Grade 0, 0603; Manufacturer: Vishay-Dale; Power_W: 100mW; TempCo: 100 ppm/C; Value_Code: 432R; Value: 432; EIA_Code: E96; SizeX_mm: 1.6; SizeY_mm: 0.8; SizeZ_mm: 1; Value2: 0.1W; SizeArea_mm2: 1.28; AEC Qualified: Y; VDC_V: 75V; AEC Category: Q200; AEC Grade: 0; Supplier Part Number 2: 52K8531; Supplier 2: Newark; Supplier Part Number 3: 71-CRCW0603-432-E3; Supplier 3: Mouser; RoHS: E; Value1: 1%; MountType: SMT; Supplier 1: Digi-Key; PackageReference: 0603; Tolerance_%: 1%; Res_ohm: 432; CompType: Resistor; PartNumber: CRCW0603432RFKEA; ComponentLink1Description: Datasheet link; Supplier Part Number 1: 541-432HCT-ND; Technology: Thick Film; ComponentLink1URL: http://www.vishay.com/docs/20035/dcrcwe3.pdf
U8 = CMP-0036258-1: Single Output LDO, 100 mA, Fixed 3.3 V Output, 3.7 to 30 V Input, -40 to 125 degC, 8-Pin SON (DRG), RoHS, Tape and Reel; Manufacturer: Texas Instruments; Fixed Output Options (V): 3.3; Iout (Max) (A): 0.1; Rating: Catalog; Vout (Max) (V): 3.333; Vin (Max) (V): 30; Vdo (Typ) (mV): 380; Iq (Typ) (mA): 0.075; Accuracy (%): 1.4; Vin (Min) (V): 3.7; Output Capacitor Type: Non-Ceramic; Vout (Min) (V): 3.267; Output Options: Fixed Output; PackageReference: DRG0008A; ComponentLink2Description: Datasheet; PackageVersion: 4205379/C; ComponentLink3Description: Package Specification; Packing: Tape and Reel; RoHS: TRUE; ComponentLink1URL: http://www.ti.com/; Mounting Technology: Surface Mount; Operating Temperature Range (C): -40 to 125; ComponentLink2URL: http://www.ti.com/lit/ds/symlink/lp2950-30.pdf; DatasheetVersion: SLVS582H; ComponentLink3URL: http://www.ti.com/lit/ml/mpds151b/mpds151b.pdf; ComponentLink1Description: Manufacturer URL; PackageDescription: 8-Pin Plastic Small Outline No-Lead, Body 3 x 3 mm, Pitch 0.5 mm; PartNumber: LP2951-33DRGR

## Sheet TLC6C598_Q1.SchDoc
size 431 x 279 mm; Date: Not shown in title block; ApprovedBy: Not shown in title block; CheckedBy: Not shown in title block; Author: Not shown in title block; CompanyName: Not shown in title block; DrawnBy: Andy Lin (TI); Engineer: Not shown in title block; Organization: Not shown in title block; Address1: Not shown in title block; Address2: Not shown in title block; Address3: Not shown in title block; Address4: Not shown in title block; DocumentNumber: 11; Revision: Use project parameter SCH_Rev; SheetNumber: 11; SheetTotal: 14; PageSetup: Record=PageOptions|CenterHorizontal=True|CenterVertical=True|PrintScale=1.00|XCorrection=1.00|YCorrection=1.00|PrintKind=0|BorderSize=5000000|LeftOffset=0|BottomOffset=0|Orientation=2|PaperLength=1000|PaperWidth=1000|Scale=100|PaperSource=15|PrintQuality=600|MediaType=1|DitherType=10|PaperKind=Letter|PrintScaleMode=1; CurrentTime: Not shown in title block; CurrentDate: Not shown in title block; Time: Not shown in title block; DocumentFullPathAndName: Not shown in title block; DocumentName: Not shown in title block; ModifiedDate: Not shown in title block; ImagePath: Not shown in title block
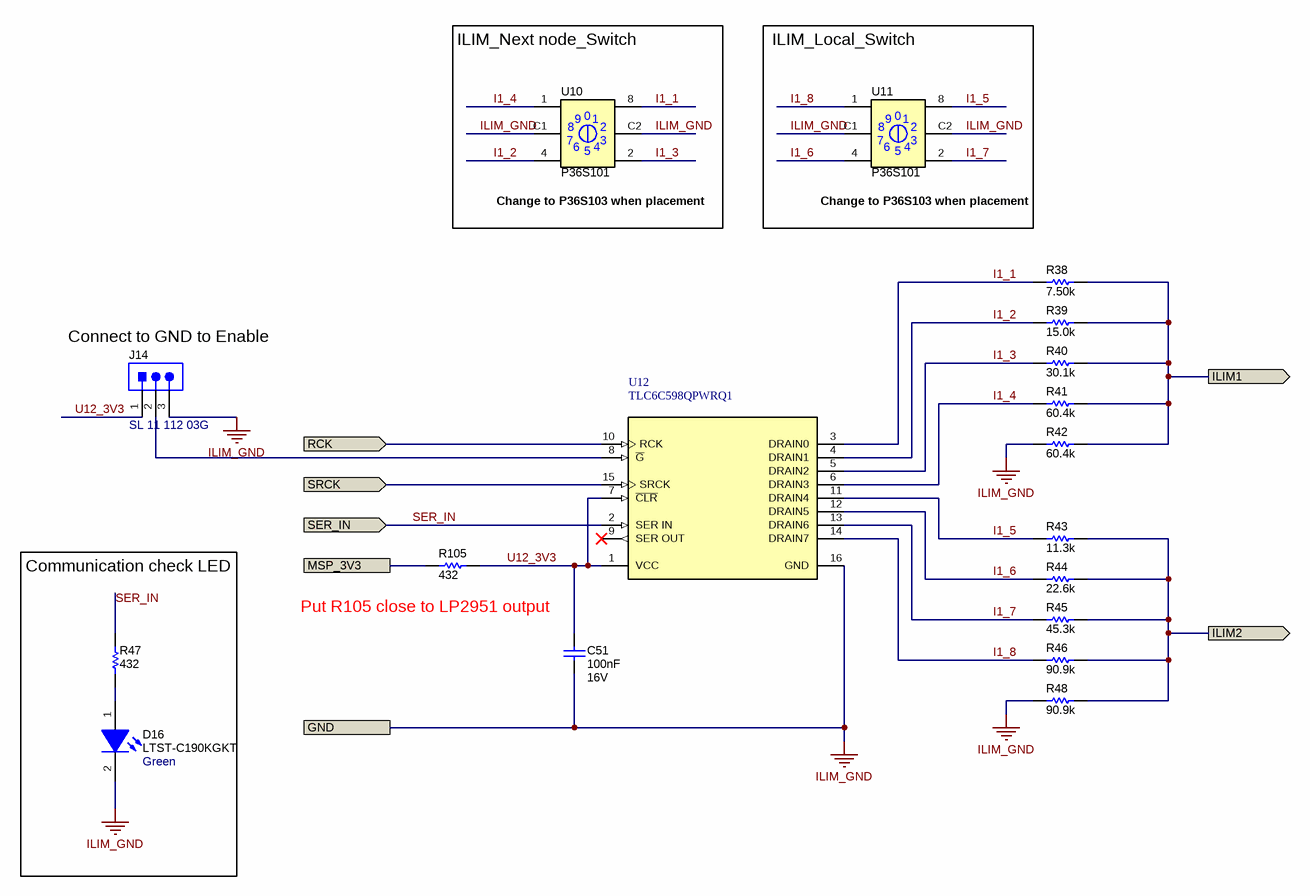
[diagram p10: TLC6C598_Q1.SchDoc]

### Parts
C51  Cap_F: 100nF  VDC_V: 16V  [0603]  (hidden comment: GRM188R71C104KA01D)
D16  LTST-C190KGKT  value Green  [LED_LTST-C190_G]
J14  SL 11 112 03G  [Fischer_SL-11-112-03G]
R38  ValueDisplayed: 7.50k  [0402]  (hidden comment: CRCW04027K50FKED)
R39  ValueDisplayed: 15.0k  [0402]  (hidden comment: CRCW040215K0FKED)
R40  ValueDisplayed: 30.1k  [0402]  (hidden comment: CRCW040230K1FKED)
R41  ValueDisplayed: 60.4k  [0402]  (hidden comment: CRCW040260K4FKED)
R42  ValueDisplayed: 60.4k  [0402]  (hidden comment: CRCW040260K4FKED)
R43  ValueDisplayed: 11.3k  [0402]  (hidden comment: CRCW040211K3FKED)
R44  ValueDisplayed: 22.6k  [0402]  (hidden comment: CRCW040222K6FKED)
R45  ValueDisplayed: 45.3k  [0402]  (hidden comment: CRCW040245K3FKED)
R46  ValueDisplayed: 90.9k  [0402]  (hidden comment: CRCW040290K9FKED)
R47  ValueDisplayed: 432  [0603]  (hidden comment: CRCW0603432RFKEA)
R48  ValueDisplayed: 90.9k  [0402]  (hidden comment: CRCW040290K9FKED)
R105  ValueDisplayed: 432  [0603]  (hidden comment: CRCW0603432RFKEA)
U10  P36S101  [Apem_P36S10x]
U11  P36S101  [Apem_P36S10x]
U12  TLC6C598QPWRQ1  [PW0016A_N]

### Blocks framed on the sheet
ILIM_Next node_Switch: U10
ILIM_Local_Switch: U11
Communication check LED: D16 R47

### Ports
GND, ILIM1 (out), ILIM2 (out), MSP_3V3, RCK (in), SER_IN (in), SRCK (in)

### Nets
ILIM_GND: C51.2 D16.2(K) J14.3 R42.1 R48.1 U10.C1 U10.C2 U11.C1 U11.C2 U12.16(GND) ; port GND
I1_1: R38.1 U10.8 U12.3(DRAIN0)
I1_2: R39.1 U10.4 U12.4(DRAIN1)
I1_3: R40.1 U10.2 U12.5(DRAIN2)
I1_4: R41.1 U10.1 U12.6(DRAIN3)
I1_5: R43.1 U11.8 U12.11(DRAIN4)
I1_6: R44.1 U11.4 U12.12(DRAIN5)
I1_7: R45.1 U11.2 U12.13(DRAIN6)
I1_8: R46.1 U11.1 U12.14(DRAIN7)
ILIM1: R38.2 R39.2 R40.2 R41.2 R42.2 ; port ILIM1
ILIM2: R43.2 R44.2 R45.2 R46.2 R48.2 ; port ILIM2
MSP_3V3: R105.2 ; port MSP_3V3
RCK: U12.10(RCK) ; port RCK
SER_IN: R47.2 U12.2(SER_IN) ; port SER_IN
SRCK: U12.15(SRCK) ; port SRCK
U12_3V3: C51.1 J14.1 R105.1 U12.1(VCC) U12.7(~{CLR})
NetD16_1: D16.1(A) R47.1
NetJ14_2: J14.2 U12.8(~{G})

Not connected (* = marked no-connect by the designer): U12 9(SER_OUT)*

### Notes on the sheet
- (near U10) Change to P36S103 when placement
- (near U11) Change to P36S103 when placement
- (near J14) Connect to GND to Enable
- Put R105 close to LP2951 output
- Drawn By:
- SVN Rev:
- Number:
- TID #:
- Orderable:
- Rev:
- Sheet Title:
- File:
- Project Title:
- Designed for:
- Assembly Variant:
- Mod. Date:
- Sheet:
- Size:
- of
- B
- http://www.ti.com
- Texas Instruments and/or its licensors do not warrant the accuracy or completeness of this specification or any information contained therein. Texas Instruments and/or its licensors do not warrant that this design will meet the specifications, will be suitable for your application or fit for any particular purpose, or will operate in an implementation. Texas Instruments and/or its licensors do not warrant that the design is production worthy. You should completely validate and test your design implementation to confirm the system functionality for your application.
- Engineer:
- Contact:
- © Texas Instruments
- (in symbol CMP-0002168-2) 0; 9; 7; 3; 6; 5

### Library data of the parts
C51 = CMP-0007378-4: CAP, CERM, 0.1 uF, 16 V, +/- 10%, X7R, 0603; Manufacturer: MuRata; TaMin_C: -55°C; Polarized: N; SizeAreaWB_mm2: 4.68; Value1: Unknown; U/M: EA; Value: 0.1uF; TaMax_C: 125°C; SizeZ_mm: 1; SizeX_mm: 1.6; SizeY_mm: 0.8; SizeArea_mm2: 1.28; AEC Category: Q200; Supplier Part Number 2: 81-GRM39X104K16; Publisher: Texas Instruments; Supplier 2: Mouser; Supplier Part Number 3: 1828890; TempCo: X7R; Supplier 3: Farnell; Published: 2008-06-19; RoHS: Y; MountType: SMT; Supplier 1: Digi-Key; PackageReference: 0603; Tolerance_%: 10%; Cap_Case: 0603; Value2: 16V; CompType: Capacitor; LatestRevisionDate: 2017-03-09; PartNumber: GRM188R71C104KA01D; AEC Qualified: ?; ComponentLink1Description: Datasheet link; Supplier Part Number 1: 490-1532-1-ND; Technology: Ceramic; ValueDisplayed: 0.1uF; ComponentLink1URL: http://search.murata.co.jp/Ceramy/PnsearchViewAction.do?HnOFG=ON&HnNFG=ON&SEL_CNT=50&sLang=en&sKey=GRM188R71C104KA01D&x=9&y=9&search=startwith
D16 = CMP-0002840-2: as D15 on sheet LP2951; PartNumber: LTST-C190KGKT; MountType: SMT; CompType: LED; Color: green; ComponentLink1Description: Datasheet link; RoHS: Y; ComponentLink1URL: http://optoelectronics.liteon.com/en-us/api/DwonloadFileHandler.ashx?txtSpecNo=DS22-2000-074&txtPartNo=LTST-C190KGKT; Vf_V: 2V; PackageReference: 1.6x0.8x0.8mm
J14 = CMP-0075048-1: Header, 2.54mm, 3x1, Gold, TH; Manufacturer: Fischer Elektronik; CT: False; CNHeader: True; ComponentLink1URL: http://www.fischerelektronik.de/web_fischer/public/index.xhtml; Publisher: Texas Instruments; CompType: Header; PackageReference: TH, 3-Leads, Body 2.5x7.62mm, Pitch 2.54mm; LatestRevisionDate: 2017-07-12; ClassName: Header; MountType: TH; PartNumber: SL 11 112 03G; ComponentLink1Description: Datasheet URL
R38 = CMP-0026555-2: RES, 7.50 k, 1%, 0.063 W, AEC-Q200 Grade 0, 0402; Manufacturer: Vishay-Dale; Power_W: 63mW; TempCo: 100 ppm/C; Value_Code: 7k50; Value: 7.50k; EIA_Code: E96; Res_ohm: 7.5k; SizeX_mm: 1; SizeY_mm: 0.5; SizeZ_mm: 0.6; Value2: 0.063W; AEC Qualified: Y; VDC_V: 50V; AEC Category: Q200; AEC Grade: 0; ComponentLink1URL: http://www.vishay.com/docs/20035/dcrcwe3.pdf; Supplier Part Number 2: 52K7245; Supplier 2: Newark; Supplier Part Number 3: 71-CRCW0402-7.5K-E3; Supplier 3: Mouser; RoHS: E; Value1: 1%; MountType: SMT; Supplier 1: Digi-Key; PackageReference: 0402; Tolerance_%: 1%; SizeArea_mm2: 0.5; CompType: Resistor; PartNumber: CRCW04027K50FKED; ComponentLink1Description: Datasheet link; Supplier Part Number 1: 541-7.50KLCT-ND; Technology: Thick Film
R39 = CMP-0026027-3: RES, 15.0 k, 1%, 0.063 W, AEC-Q200 Grade 0, 0402; Manufacturer: Vishay-Dale; Power_W: 63mW; TempCo: 100 ppm/C; Value_Code: 15k0; Value: 15.0k; EIA_Code: E96; Res_ohm: 15k; SizeX_mm: 1; SizeY_mm: 0.5; SizeZ_mm: 0.6; Value2: 0.063W; AEC Qualified: Y; VDC_V: 50V; AEC Category: Q200; AEC Grade: 0; Supplier Part Number 2: 52K6708; Supplier 2: Newark; Supplier Part Number 3: 71-CRCW0402-15K-E3; Supplier 3: Mouser; RoHS: E; Value1: 1%; MountType: SMT; Supplier 1: Digi-Key; PackageReference: 0402; Tolerance_%: 1%; SizeArea_mm2: 0.5; CompType: Resistor; PartNumber: CRCW040215K0FKED; ComponentLink1Description: Datasheet link; Supplier Part Number 1: 541-15.0KLCT-ND; Technology: Thick Film; ComponentLink1URL: http://www.vishay.com/docs/20035/dcrcwe3.pdf
R40 = CMP-0026284-2: RES, 30.1 k, 1%, 0.063 W, AEC-Q200 Grade 0, 0402; Manufacturer: Vishay-Dale; Power_W: 63mW; TempCo: 100 ppm/C; Value_Code: 30k1; Value: 30.1k; EIA_Code: E96; SizeX_mm: 1; SizeY_mm: 0.5; SizeZ_mm: 0.6; Value2: 0.063W; AEC Qualified: Y; VDC_V: 50V; AEC Category: Q200; AEC Grade: 0; ComponentLink1URL: http://www.vishay.com/docs/20035/dcrcwe3.pdf; Supplier Part Number 2: 52K6954; Supplier 2: Newark; Supplier Part Number 3: 71-CRCW0402-30.1K-E3; Supplier 3: Mouser; RoHS: E; Value1: 1%; MountType: SMT; Supplier 1: Digi-Key; PackageReference: 0402; Tolerance_%: 1%; Res_ohm: 30.1k; SizeArea_mm2: 0.5; CompType: Resistor; PartNumber: CRCW040230K1FKED; ComponentLink1Description: Datasheet link; Supplier Part Number 1: 541-30.1KLCT-ND; Technology: Thick Film
R41 R42 = CMP-0026486-2: RES, 60.4 k, 1%, 0.063 W, AEC-Q200 Grade 0, 0402; Manufacturer: Vishay-Dale; Power_W: 63mW; TempCo: 100 ppm/C; Value_Code: 60k4; Value: 60.4k; EIA_Code: E96; SizeX_mm: 1; SizeY_mm: 0.5; SizeZ_mm: 0.6; Value2: 0.063W; AEC Qualified: Y; VDC_V: 50V; AEC Category: Q200; AEC Grade: 0; ComponentLink1URL: http://www.vishay.com/docs/20035/dcrcwe3.pdf; Supplier Part Number 2: 52K7190; Supplier 2: Newark; Supplier Part Number 3: 71-CRCW0402-60.4K-E3; Supplier 3: Mouser; RoHS: E; Value1: 1%; MountType: SMT; Supplier 1: Digi-Key; PackageReference: 0402; Tolerance_%: 1%; Res_ohm: 60.4k; SizeArea_mm2: 0.5; CompType: Resistor; PartNumber: CRCW040260K4FKED; ComponentLink1Description: Datasheet link; Supplier Part Number 1: 541-60.4KLCT-ND; Technology: Thick Film
R43 = CMP-0025976-3: RES, 11.3 k, 1%, 0.063 W, AEC-Q200 Grade 0, 0402; Manufacturer: Vishay-Dale; Power_W: 63mW; TempCo: 100 ppm/C; Value_Code: 11k3; Value: 11.3k; EIA_Code: E96; SizeX_mm: 1; SizeY_mm: 0.5; SizeZ_mm: 0.6; Value2: 0.063W; AEC Qualified: Y; VDC_V: 50V; AEC Category: Q200; AEC Grade: 0; Supplier Part Number 2: 52K6622; Supplier 2: Newark; Supplier Part Number 3: 71-CRCW0402-11.3K-E3; Supplier 3: Mouser; RoHS: E; Value1: 1%; MountType: SMT; Supplier 1: Digi-Key; PackageReference: 0402; Tolerance_%: 1%; Res_ohm: 11.3k; SizeArea_mm2: 0.5; CompType: Resistor; PartNumber: CRCW040211K3FKED; ComponentLink1Description: Datasheet link; Supplier Part Number 1: 541-11.3KLCT-ND; Technology: Thick Film; ComponentLink1URL: http://www.vishay.com/docs/20035/dcrcwe3.pdf
R44 = CMP-0026179-2: RES, 22.6 k, 1%, 0.063 W, AEC-Q200 Grade 0, 0402; Manufacturer: Vishay-Dale; Power_W: 63mW; TempCo: 100 ppm/C; Value_Code: 22k6; Value: 22.6k; EIA_Code: E96; SizeX_mm: 1; SizeY_mm: 0.5; SizeZ_mm: 0.6; Value2: 0.063W; AEC Qualified: Y; VDC_V: 50V; AEC Category: Q200; AEC Grade: 0; ComponentLink1URL: http://www.vishay.com/docs/20035/dcrcwe3.pdf; Supplier Part Number 2: 52K6845; Supplier 2: Newark; Supplier Part Number 3: 71-CRCW0402-22.6K-E3; Supplier 3: Mouser; RoHS: E; Value1: 1%; MountType: SMT; Supplier 1: Digi-Key; PackageReference: 0402; Tolerance_%: 1%; Res_ohm: 22.6k; SizeArea_mm2: 0.5; CompType: Resistor; PartNumber: CRCW040222K6FKED; ComponentLink1Description: Datasheet link; Supplier Part Number 1: 541-22.6KLCT-ND; Technology: Thick Film
R45 = CMP-0026387-2: RES, 45.3 k, 1%, 0.063 W, AEC-Q200 Grade 0, 0402; Manufacturer: Vishay-Dale; Power_W: 63mW; TempCo: 100 ppm/C; Value_Code: 45k3; Value: 45.3k; EIA_Code: E96; SizeX_mm: 1; SizeY_mm: 0.5; SizeZ_mm: 0.6; Value2: 0.063W; AEC Qualified: Y; VDC_V: 50V; AEC Category: Q200; AEC Grade: 0; ComponentLink1URL: http://www.vishay.com/docs/20035/dcrcwe3.pdf; Supplier Part Number 2: 52K7083; Supplier 2: Newark; Supplier Part Number 3: 71-CRCW0402-45.3K-E3; Supplier 3: Mouser; RoHS: E; Value1: 1%; MountType: SMT; Supplier 1: Digi-Key; PackageReference: 0402; Tolerance_%: 1%; Res_ohm: 45.3k; SizeArea_mm2: 0.5; CompType: Resistor; PartNumber: CRCW040245K3FKED; ComponentLink1Description: Datasheet link; Supplier Part Number 1: 541-45.3KLCT-ND; Technology: Thick Film
R46 R48 = CMP-0026605-2: RES, 90.9 k, 1%, 0.063 W, AEC-Q200 Grade 0, 0402; Manufacturer: Vishay-Dale; Power_W: 63mW; TempCo: 100 ppm/C; Value_Code: 90k9; Value: 90.9k; EIA_Code: E96; SizeX_mm: 1; SizeY_mm: 0.5; SizeZ_mm: 0.6; Value2: 0.063W; AEC Qualified: Y; VDC_V: 50V; AEC Category: Q200; AEC Grade: 0; ComponentLink1URL: http://www.vishay.com/docs/20035/dcrcwe3.pdf; Supplier Part Number 2: 52K7338; Supplier 2: Newark; Supplier Part Number 3: 71-CRCW0402-90.9K-E3; Supplier 3: Mouser; RoHS: E; Value1: 1%; MountType: SMT; Supplier 1: Digi-Key; PackageReference: 0402; Tolerance_%: 1%; Res_ohm: 90.9k; SizeArea_mm2: 0.5; CompType: Resistor; PartNumber: CRCW040290K9FKED; ComponentLink1Description: Datasheet link; Supplier Part Number 1: 541-90.9KLCT-ND; Technology: Thick Film
R47 R105 = CMP-0022421-5: as R34 on sheet LP2951; Supplier Part Number 2: 52K8531; Supplier 2: Newark; Supplier Part Number 3: 71-CRCW0603-432-E3; Supplier 3: Mouser; RoHS: E; Value1: 1%; MountType: SMT; Supplier 1: Digi-Key; PackageReference: 0603; Tolerance_%: 1%; Res_ohm: 432; CompType: Resistor; PartNumber: CRCW0603432RFKEA; ComponentLink1Description: Datasheet link; Supplier Part Number 1: 541-432HCT-ND; Technology: Thick Film; ComponentLink1URL: http://www.vishay.com/docs/20035/dcrcwe3.pdf
U10 U11 = CMP-0002168-2: Switch, Rotary dip, 10POS, BCD, 24V, SMT; Manufacturer: APEM; CurrentRating_mA: 100A; PositionCount: 10; Supplier 2: Newark; Supplier 3: Mouser; Supplier 1: Digi-Key; Supplier Part Number 1: 679-1953-ND; Supplier Part Number 2: 92K8405; Supplier Part Number 3: 642-P36S101; PartNumber: P36S101; ComponentLink1Description: Datasheet URL; LatestRevisionDate: 2017-03-09; CompType: Switch; PackageReference: Switch, 7.4x3.8x7.4mm; Publisher: Texas Instruments; Circuit: BCD; VDC_V: 24V; RoHS: Y; Orientation: Top Actuated; MountType: SMT; ComponentLink1URL: http://www.apem.com/files/apem/brochures/P36.pdf
U12 = CMP-0044767-1: Automotive Power Logic 8-Bit Shift Register LED Driver, PW0016A, LARGE T&R; Generic Part Number: TLC6C598-Q1; Manufacturer: Texas Instruments; rDS(on)(Ohms): 7.4; IO(CONT)(A): 0.05; VDS(Max)(V): 40; ICC(uA): 88; tPLH(ns): 218; Rating: Automotive; PackageReference: PW0016A; DatasheetVersion: SLIS142B; Operating Temperature Range(C): -40 to 125